# Altium schematic sheet Short to VCC protection.SchDoc
size A4
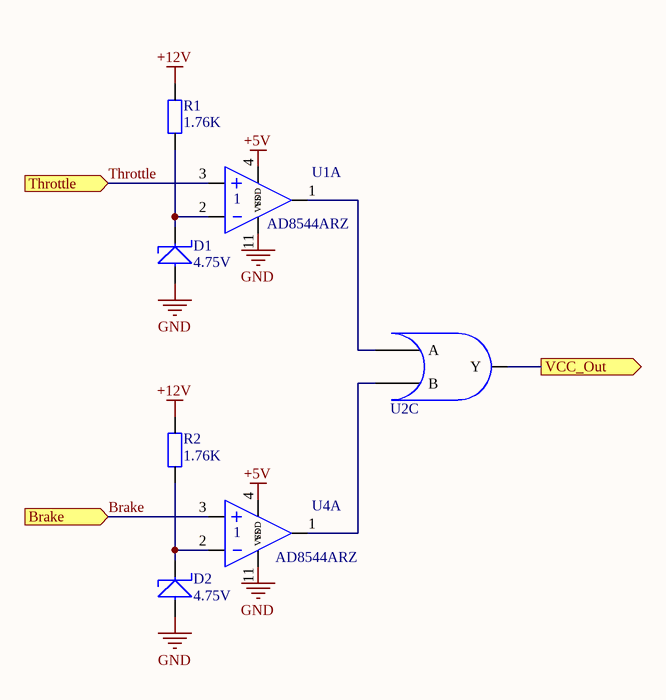
[diagram p0: Short to VCC protection.SchDoc]

## Parts
D1  4.75V  [SODFL360X160X130L80X100N]
D2  4.75V  [SODFL360X160X130L80X100N]
R1  1.76K  [RESC160X80X50L30N]
R2  1.76K  [RESC160X80X50L30N]
U1  AD8544ARZ  [SOIC14P127_865X600X175L83X41N]  (part A of 4)
U2  CD4071BM  [SOIC14P127_865X600X175L70X42N]  (value not drawn)  (part C of 4)
U4  AD8544ARZ  [SOIC14P127_865X600X175L83X41N]  (part A of 4)

## Ports
Brake (in), Throttle (in), VCC_Out (out)

## Nets
+5V: U1.4(VDD) U4.4(VDD)
+12V: R1.1 R2.1
GND: D1.A D2.A U1.11(VSS) U4.11(VSS)
Brake: U4.3 ; port Brake
Throttle: U1.3 ; port Throttle
VCC_Out: U2.10(Y) ; port VCC_Out
NetD1_C: D1.C R1.2 U1.2
NetD2_C: D2.C R2.2 U4.2
NetU1_1: U1.1 U2.8(A)
NetU2_9: U2.9(B) U4.1

## Library data of the parts
D1 D2 = D_4.75V_625mW: Manufacturer Part Number: PDZ4.7BGWX; Tolerance: 2 %; Power Dissipation: 625mW; Diode Case Style: SOD-123-2; ComponentLinkDescription: Datasheet; FR_SN: D_Z-03; Part Number: D_4.75V_625mW; Voltage Rating: 4.75V; Value: 4.75V; ComponentLinkURL: https://hr.mouser.com/datasheet/2/916/PDZ-GW_SER-1599748.pdf; Supplier Part Number: 771-PDZ4.7BGWX
R1 R2 = R_0603_1.76K_0W1_P: Manufacturer Part Number: RT0603BRD071K76L; Power Rating: 100mW; Resistor Case Style: 0603; Temperature Coefficient: 25 PPM / C; FR_SN: R-15; Part Number: R_0603_1.76K_0W1_P; Value: 1.76K; ComponentLink1URL: https://hr.mouser.com/ProductDetail/Yageo/RT0603BRD071K76L?qs=sGAEpiMZZMu61qfTUdNhGyjxuWj6R%252BAvNaA7oRf469yqgHOwdPrDqQ%3D%3D; ComponentLink1Description: Datasheet; Supplier Part Number: 603-RT0603BRD071K76L
U1 U4 = AD8544: Manufacturer Part Number: AD8544ARZ-REEL; IC Case Style: SOIC-14; ComponentLinkDescription: Datasheet; FR_SN: U_Analog-15; Part Number: AD8544; Value: AD8544ARZ; Category: OP Amp; ComponentLinkURL: https://hr.mouser.com/datasheet/2/609/AD8541_8542_8544-1502176.pdf; Supplier Part Number: 584-AD8544ARZ-R
U2 = CD4071BM: IC Case Style: SO-14; ComponentLinkDescription: Datasheet; FR_SN: IC_Misc-21; Part Number: CD4071BM; Value: CD4071BM; Category: Logic OR Gate; Manufacturer Part Number: CD4071BM; ComponentLinkURL: https://www.ti.com/general/docs/suppproductinfo.tsp?distId=26&gotoUrl=http%3A%2F%2Fwww.ti.com%2Flit%2Fgpn%2Fcd4071b; Supplier Part Number: 595-CD4071BM